# Altium schematic sheet compute module HDMI out.SchDoc: Compute Module HDMI/Camera
size A4; Organization: Blinkinlabs, LLC; DocumentNumber: 5; SheetNumber: 5; SheetTotal: 14
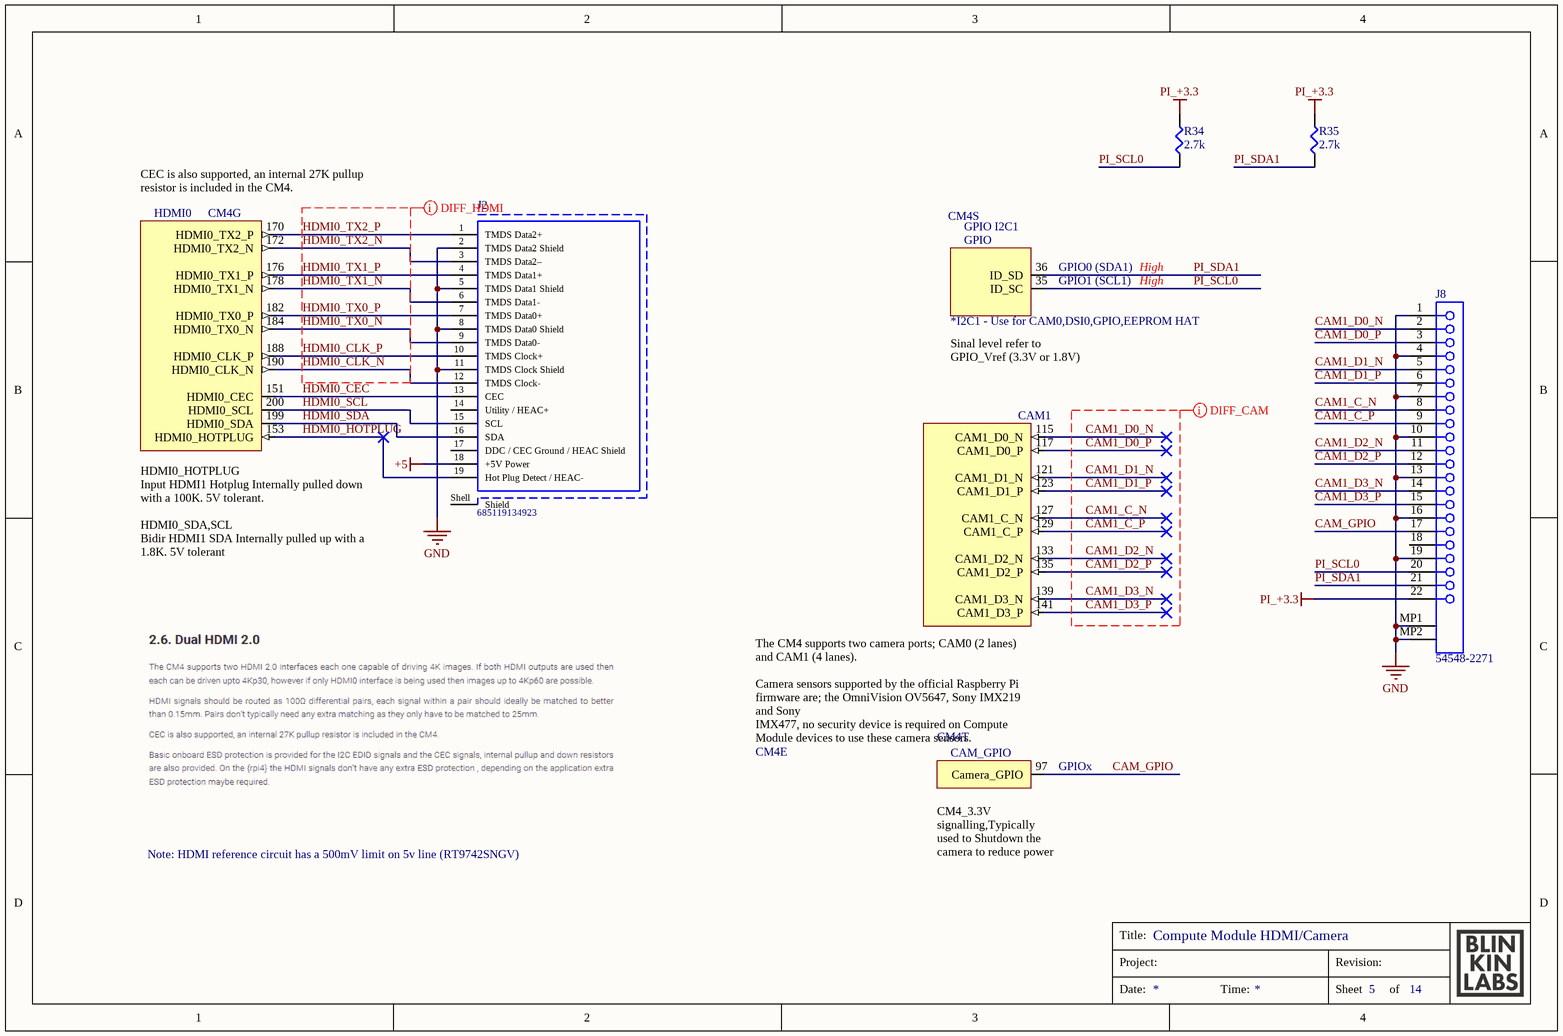
[diagram p0: compute module HDMI out.SchDoc]

## Parts
CM4  Raspberry Pi Compute Module 4  [CM4-F40C-100DS-0.4v_1.5mm_0mm]  (value not drawn)  (parts E,G,S,T of 21)
J2  685119134923  [685119134923]
J8  54548-2271  [MOLX-54548-2271]
R34  2.7k  [ERJ2G(0402)_L]
R35  2.7k  [ERJ2G(0402)_L]

## Nets
+5: J2.18(+5V_Power)
GND: J2.2(TMDS_Data2_Shield) J2.5(TMDS_Data1_Shield) J2.8(TMDS_Data0_Shield) J2.11(TMDS_Clock_Shield) J8.1 J8.4 J8.7 J8.10 J8.13 J8.16 J8.19 J8.MP1 J8.MP2
PI_+3.3: J8.22 R34.2 R35.2
CAM1_C_N: CM4.127(CAM1_C_N) J8.8
CAM1_C_P: CM4.129(CAM1_C_P) J8.9
CAM1_D0_N: CM4.115(CAM1_D0_N) J8.2
CAM1_D0_P: CM4.117(CAM1_D0_P) J8.3
CAM1_D1_N: CM4.121(CAM1_D1_N) J8.5
CAM1_D1_P: CM4.123(CAM1_D1_P) J8.6
CAM1_D2_N: CM4.133(CAM1_D2_N) J8.11
CAM1_D2_P: CM4.135(CAM1_D2_P) J8.12
CAM1_D3_N: CM4.139(CAM1_D3_N) J8.14
CAM1_D3_P: CM4.141(CAM1_D3_P) J8.15
CAM_GPIO: CM4.97(Camera_GPIO) J8.17
HDMI0_CEC: CM4.151(HDMI0_CEC) J2.13(CEC)
HDMI0_CLK_N: CM4.190(HDMI0_CLK_N) J2.12(TMDS_Clock-)
HDMI0_CLK_P: CM4.188(HDMI0_CLK_P) J2.10(TMDS_Clock+)
HDMI0_HOTPLUG: CM4.153(HDMI0_HOTPLUG) J2.19(Hot_Plug_Detect_/_HEAC-)
HDMI0_SCL: CM4.200(HDMI0_SCL) J2.15(SCL)
HDMI0_SDA: CM4.199(HDMI0_SDA) J2.16(SDA)
HDMI0_TX0_N: CM4.184(HDMI0_TX0_N) J2.9(TMDS_Data0-)
HDMI0_TX0_P: CM4.182(HDMI0_TX0_P) J2.7(TMDS_Data0+)
HDMI0_TX1_N: CM4.178(HDMI0_TX1_N) J2.6(TMDS_Data1-)
HDMI0_TX1_P: CM4.176(HDMI0_TX1_P) J2.4(TMDS_Data1+)
HDMI0_TX2_N: CM4.172(HDMI0_TX2_N) J2.3(TMDS_Data2–)
HDMI0_TX2_P: CM4.170(HDMI0_TX2_P) J2.1(TMDS_Data2+)
PI_SCL0: CM4.35(ID_SC) J8.20 R34.1
PI_SDA1: CM4.36(ID_SD) J8.21 R35.1

Not connected (* = marked no-connect by the designer): J2 14(Utility_/_HEAC+) 17(DDC_/_CEC_Ground_/_HEAC_Shield) Shell(Shield); J8 18

## Layout directives
differential pair; differential pair class DIFF_100Ohm_HDMI; differential pair class DIFF_HDMI; net class HDMI; rule Matched Net Lengths [Tolerance = 0.15mm]: HDMI0_CLK_N, HDMI0_CLK_P, HDMI0_TX0_N, HDMI0_TX0_P, HDMI0_TX1_N, HDMI0_TX1_P, HDMI0_TX2_N, HDMI0_TX2_P
differential pair; differential pair class DIFF_100Ohm_HDMI; differential pair class DIFF_CAM; net class CAM; rule Matched Net Lengths [Tolerance = 0.15mm]: CAM1_C_N, CAM1_C_P, CAM1_D0_N, CAM1_D0_P, CAM1_D1_N, CAM1_D1_P, CAM1_D2_N, CAM1_D2_P, CAM1_D3_N, CAM1_D3_P

## Notes on the sheet
- Note: HDMI reference circuit has a 500mV limit on 5v line (RT9742SNGV)
- Title:
- Project:
- Revision:
- Date:
- Time:
- Sheet
- of
- (in symbol CM4, part E) CAM1; The CM4 supports two camera ports; CAM0 (2 lanes) and CAM1 (4 lanes). / Camera sensors supported by the official Raspberry Pi firmware are; the OmniVision OV5647, Sony IMX219 and Sony / IMX477, no security device is required on Compute Module devices to use these camera sensors.
- (in symbol CM4, part G) CEC is also supported, an internal 27K pullup resistor is included in the CM4.; HDMI0; HDMI0_HOTPLUG / Input HDMI1 Hotplug Internally pulled down with a 100K. 5V tolerant.; HDMI0_SDA,SCL / Bidir HDMI1 SDA Internally pulled up with a 1.8K. 5V tolerant
- (in symbol CM4, part S) GPIO I2C1; GPIO; GPIO0 (SDA1); High; GPIO1 (SCL1); *I2C1 - Use for CAM0,DSI0,GPIO,EEPROM HAT; Sinal level refer to  GPIO_Vref (3.3V or 1.8V)
- (in symbol CM4, part T) CAM_GPIO; GPIOx; CM4_3.3V signalling,Typically used to Shutdown the camera to reduce power

## Library data of the parts
CM4 = CM4: Raspberry Pi Compute Module 4 by Amornthep Phunsin
J2 = CMP-1502-00169-1: HDMI Type A Receptacle WR-HDMI, Horizontal, SMT; Manufacturer: Wurth Elektronik; Contact Resistance: 30mOhm; Working Voltage: 40VDC; Rated Current: 0.5A; Publisher: WurthElektronik; Datasheet URL: https://katalog.we-online.de/em/datasheet/685119134923.pdf; Gender: Receptacle; Manufacturer URL: http://www.we-online.de; Orientation: Horizontal; Mounting Technology: SMT; Part Number: 685119134923; Packaging: TapeandReel; Package Reference: 685119134923; Operating Temperature: -20to85degC; Connector Type: HDMITypeA
J8 = CMP-1241-00555-1: 0.5 mm Pitch Easy-On(TM) Type FPC Connector, 1.2 mm Mated Height, Right Angle, ZIF, SMT, Bottom Contact, 22 Circuits, -20 to 85 degC, ELV and RoHS Compliant, Tape and Reel; Manufacturer: Molex; Circuits (Loaded): 22; Stackable: No; Material - Plating Termination: Tin; PCB Retention: Yes; Entry Angle: 90degrees Angle; Material - Plating Mating: Gold; Current (Max per Contact): 0.5A; Material - Metal: Phosphor Bronze; Voltage (Max): 50V; Mated Height: 1.20mm; Pitch - Mating Interface: 0.50mm; Durability (mating cycles max): 20; PackageVersion: Rev. N, 06/2008; PackageDescription: 22-Lead FPC Connector, Pitch 0.5 mm; PackageReference: 54548-2271; ComponentLink2Description: Datasheet; PartNumber: 54548-2271; ComponentLink3URL: http://www.molex.com/pdm_docs/sd/545482171_sd.pdf; Contact Position: Bottom; Packing: Tape and Reel; ComponentLink1URL: http://www.molex.com/molex/index.jsp; Mounting Technology: Surface Mount; ComponentLink3Description: Package Specification; PCB Locator: No; ComponentLink2URL: http://www.molex.com/webdocs/datasheets/pdf/en-us/0545482271_FFC_FPC_CONNECTORS.pdf; Orientation: Right Angle; Number of Rows: 1; RoHS: TRUE; Polarized to PCB: Yes; ComponentLink1Description: Manufacturer URL
R34 R35 = ERJ-2RKF2701X: RES SMD 2.7K OHM 1% 1/10W 0402; Manufacturer: Panasonic Electronic Components; Power (Watts): 0.1W, 1/10W; Temperature Coefficient: ±100ppm/°C; PartNumber: ERJ-2RKF2701X; Datasheets: http://industrial.panasonic.com/www-cgi/jvcr13pz.cgi?E+PZ+3+AOA0002+ERJ2RKF2701X+7+WW; Image: //media.digikey.com/Photos/Panasonic%20Photos/ERJ-PA2-Series.jpg; Digi-Key Part Number: P2.70KLCT-ND; Series: ERJ; Value: 2.7k; Tolerance: ±1%; Composition: Thick Film; Features: Automotive AEC-Q200; Operating Temperature: -55°C ~ 155°C; Package / Case: 0402 (1005 Metric); Case/Package: 0402; Size / Dimension: 0.039" L x 0.020" W (1.00mm x 0.50mm); Height - Seated (Max): 0.016" (0.40mm); Number of Terminations: 2